# EasyEDA schematic 1-Schematic_petdaktil.json
TITLE: Petdaktil; REV: 1.0; Date: 2023-11-15; Sheet: 1/1; Drawn By: matic.morgan; Company: private
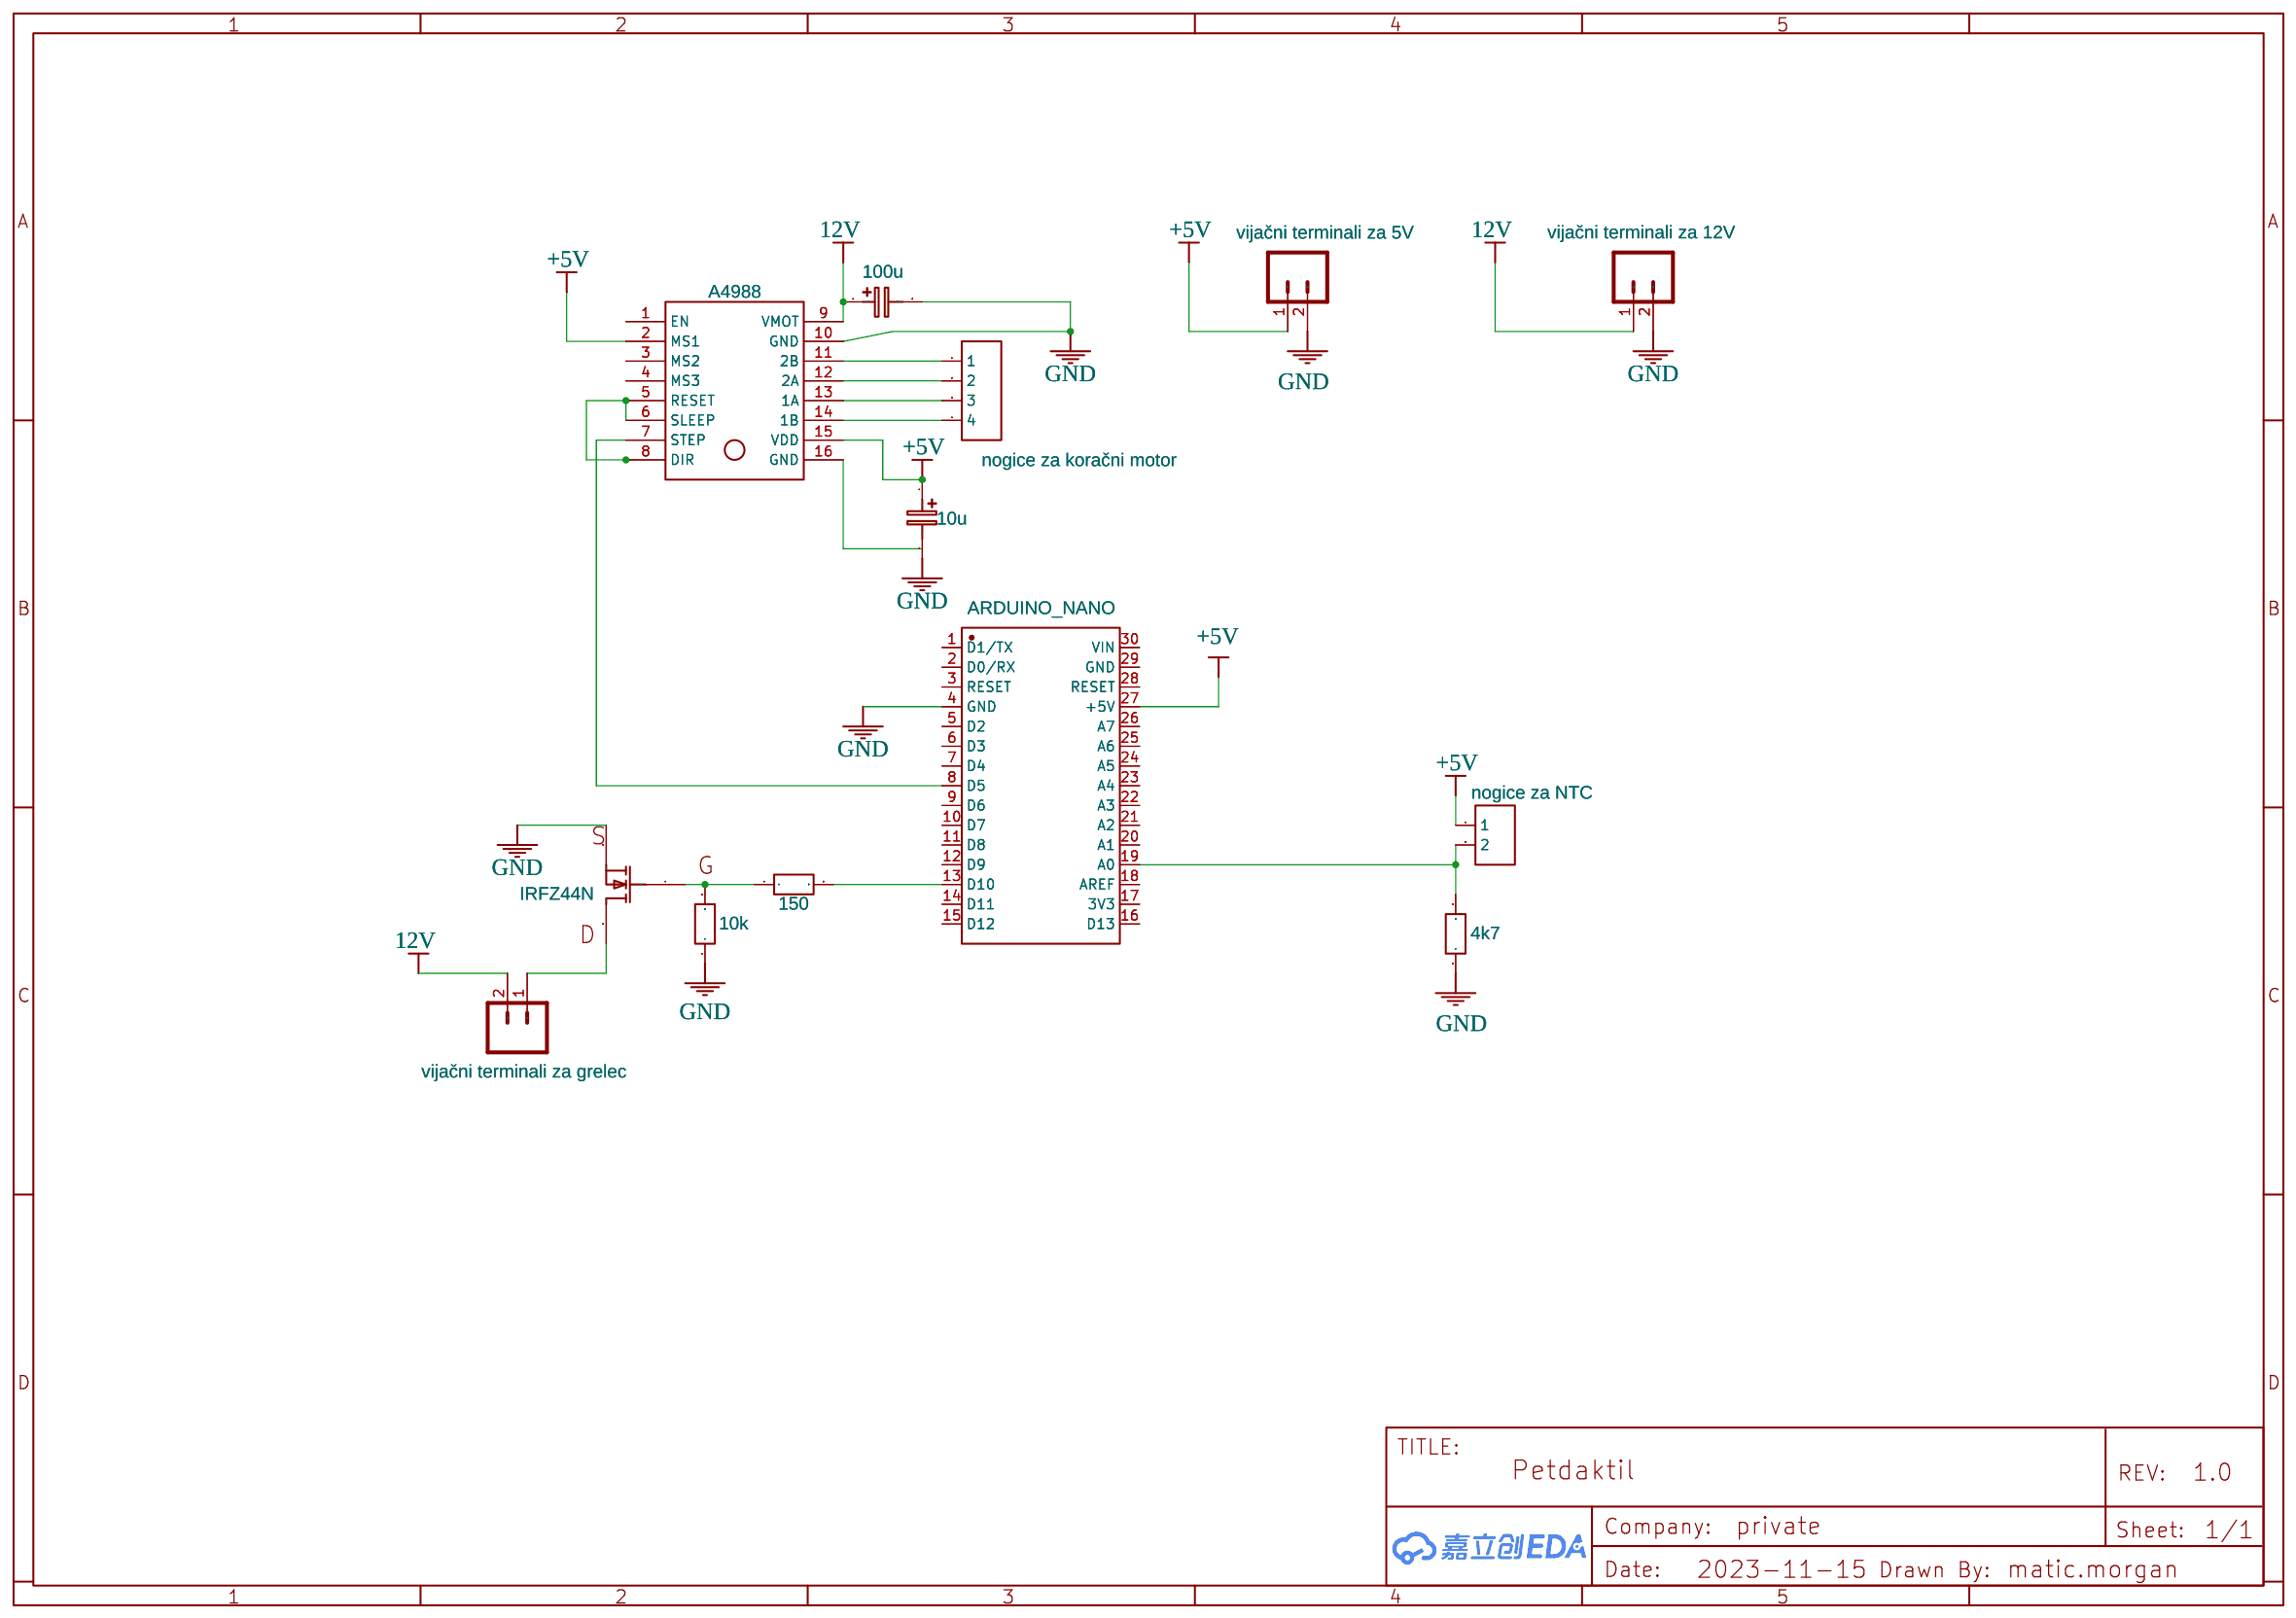
[diagram p0: schematic sheet]

## Parts
C11  100u  [CAP-D8.0×F3.5]
C21  10u  [CAP-D5.0×F2.0]
H11  nogice za NTC  [HDR-F-2.54_1X2]
J11  nogice za koračni motor  [HDR-M-2.54_1X4]
JP11  vijačni terminali za grelec  [SCREWTERMINAL-3.5MM-2-NS]
JP21  vijačni terminali za 12V  [SCREWTERMINAL-3.5MM-2-NS]
JP31  vijačni terminali za 5V  [SCREWTERMINAL-3.5MM-2-NS]
Q11  IRFZ44N  [IRFZ44N]
R11  150  [R_AXIAL-0.3]
R21  4k7  [R_AXIAL-0.3]
R31  10k  [R_AXIAL-0.3]
U1  ARDUINO_NANO  [COMM-TH_ARDUINO_NANO]
U11  A4988  [A4988(K)]

## Library data of the parts
C11 = CE_TH_D8.0×F3.5_EU: Contributor: LCEDA_Lib; Package Display: No
C21 = CE_TH_D5.0×F2.0_EU: Contributor: LCEDA_Lib; Package Display: No
H11 = HDR-F-2.54_1x2: Supplier Part: C49661; Supplier: LCSC; Contributor: LCEDA_Lib; Package Display: No
J11 = HDR-M-2.54_1x4: Supplier Part: C124378; Supplier: LCSC; Contributor: LCEDA_Lib; Package Display: No
JP11 JP21 JP31 = M023.5MM-NO_SILK: Standard 2-pin 0.1 header. Use with; Contributor: SparkFun; Package Display: No
Q11 = IRFZ44N COPY: HEXFET Power MOSFET; Contributor: Brandon Soto; Package Display: No
R11 R21 R31 = R_AXIAL-0.3_EU: Contributor: LCEDA_Lib; Package Display: No
U1 = ARDUINO_NANO: Contributor: lcsc; Supplier: LCSC; Supplier Part: C9900017879; Manufacturer: null; JLCPCB Part Class: Extended Part
U11 = ДРАЙВЕР ДВИГАТЕЛЯ A4988 COPY COPY: Manufacturer Part: ДРАЙВЕР ДВИГАТЕЛЯ A4988; Contributor: misssvet; Package Display: No

## Nets
12V: C11.1 JP11.2 JP21.1 U11.9(VMOT)
+5V: C21.1 H11.1 JP31.1 U1.27(+5V) U11.2(MS1) U11.15(VDD)
GND: C11.2 C21.2 JP21.2 JP31.2 Q11.3(S) R21.1 R31.1 U1.4(GND) U11.10(GND)
Net-(H11-2): H11.2 R21.2 U1.19(A0)
Net-(J11-1): J11.1 U11.11(2B)
Net-(J11-2): J11.2 U11.12(2A)
Net-(J11-3): J11.3 U11.13(1A)
Net-(J11-4): J11.4 U11.14(1B)
Net-(JP11-1): JP11.1 Q11.2(D)
Net-(Q11-1): Q11.1(G) R11.1 R31.2
Net-(R11-2): R11.2 U1.13(D10)
Net-(U1-8): U1.8(D5) U11.7(STEP)
Net-(U11-5): U11.5(RESET) U11.6(SLEEP) U11.8(DIR)

Not connected (* = marked no-connect by the designer): U1 1(D1/TX) 2(D0/RX) 3(RESET) 5(D2) 6(D3) 7(D4) 9(D6) 10(D7) 11(D8) 12(D9) 14(D11) 15(D12) 16(D13) 17(3V3) 18(AREF) 20(A1) 21(A2) 22(A3) 23(A4) 24(A5) 25(A6) 26(A7) 28(RESET) 29(GND) 30(VIN); U11 1(EN) 3(MS2) 4(MS3) 16(GND)
